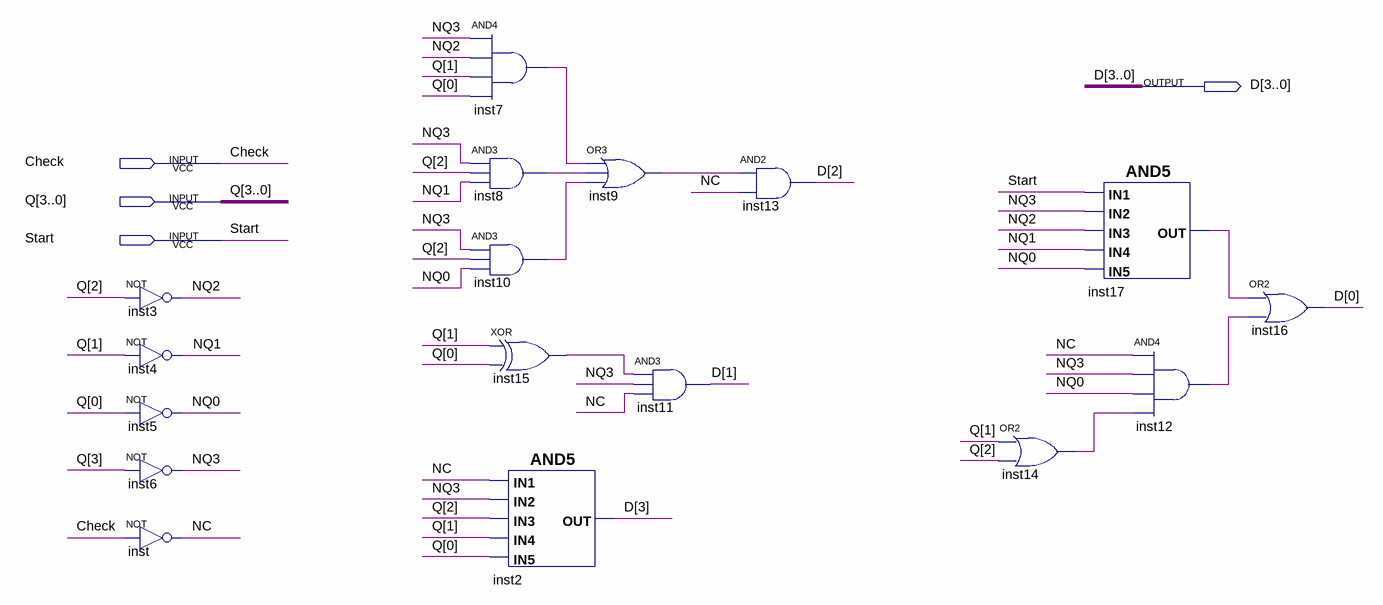
[diagram p0: schematic sheet]
// Quartus schematic NextState.bdf as structural Verilog: 17 symbols, 4 pins
module NextState (
  input  Check,
  input  [3:0] Q,
  input  Start,
  output [3:0] D
);

  wire inst7_out, inst8_out, inst9_out, inst10_out, inst12_out, inst14_out, inst15_out, inst17_out, NC, NQ0,
       NQ1, NQ2, NQ3;

  not inst3 (NQ2, Q[2]);
  not inst4 (NQ1, Q[1]);
  not inst5 (NQ0, Q[0]);
  not inst6 (NQ3, Q[3]);
  not inst (NC, Check);
  and inst7 (inst7_out, NQ3, NQ2, Q[1], Q[0]);
  and inst8 (inst8_out, NQ3, Q[2], NQ1);
  and inst10 (inst10_out, NQ3, Q[2], NQ0);
  xor inst15 (inst15_out, Q[1], Q[0]);
  and inst2 (D[3], NC, NQ3, Q[2], Q[1], Q[0]);
  or inst9 (inst9_out, inst7_out, inst8_out, inst10_out);
  and inst11 (D[1], inst15_out, NQ3, NC);
  and inst13 (D[2], inst9_out, NC);
  or inst14 (inst14_out, Q[1], Q[2]);
  and inst17 (inst17_out, Start, NQ3, NQ2, NQ1, NQ0);
  and inst12 (inst12_out, NC, NQ3, NQ0, inst14_out);
  or inst16 (D[0], inst17_out, inst12_out);
endmodule
